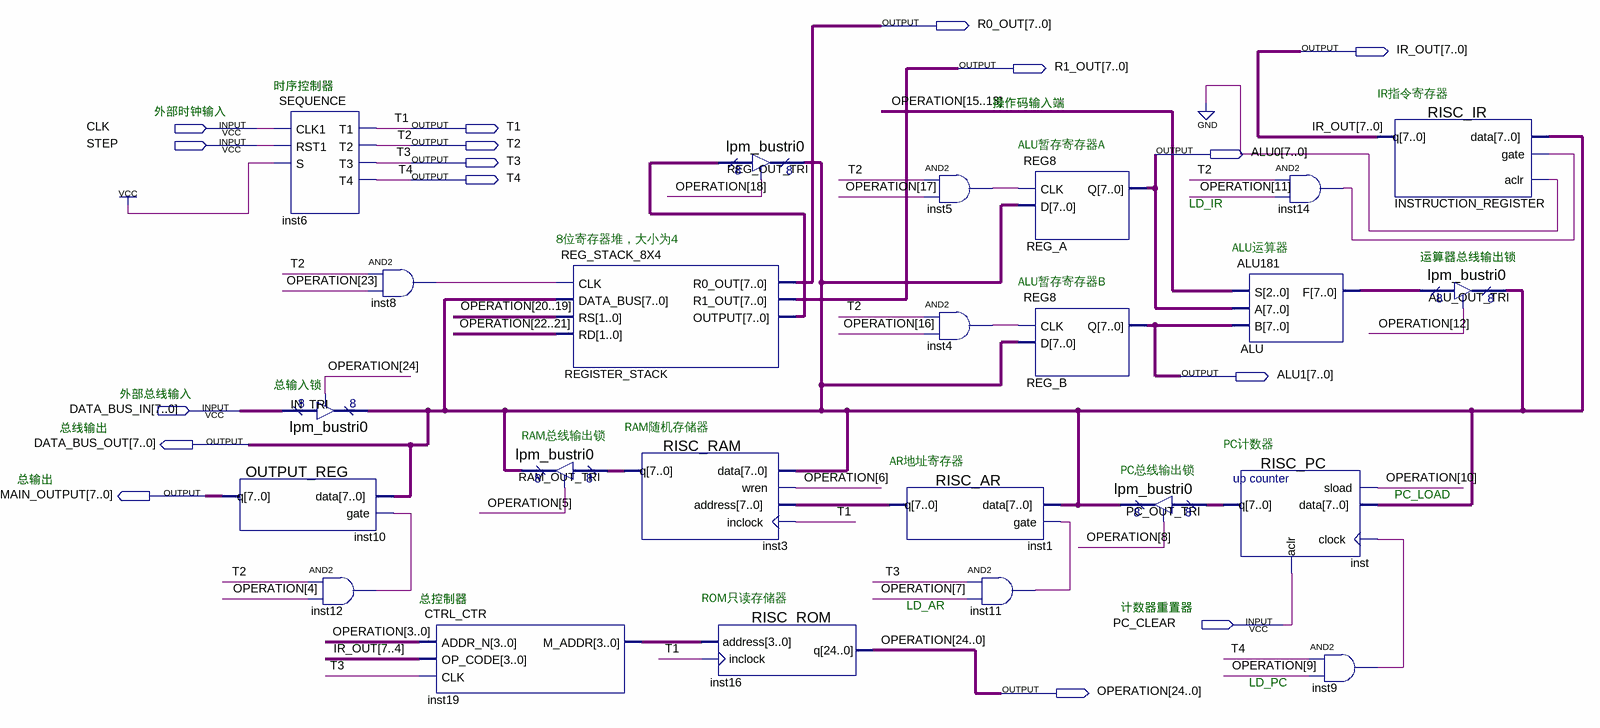
[diagram p0: schematic sheet]
// Quartus schematic RISC_FINALE.bdf as structural Verilog: 24 symbols, 16 pins
module RISC_FINALE (
  input  CLK,
  input  STEP,
  input  [7:0] DATA_BUS_IN,
  input  PC_CLEAR,
  output [7:0] R0_OUT,
  output [7:0] IR_OUT,
  output [7:0] R1_OUT,
  output T1,
  output T2,
  output [7:0] ALU0,
  output T3,
  output T4,
  output [7:0] ALU1,
  output [7:0] DATA_BUS_OUT,
  output [7:0] MAIN_OUTPUT,
  output [24:0] OPERATION
);

  wire inst4_out, inst5_out, inst8_out, inst9_out, inst11_out, inst12_out, inst14_out;
  wire [3:0] inst19_m_addr;
  wire [7:0] ALU_f, inst1_q, inst3_q, inst_q, REGISTER_STACK_output;

  SEQUENCE inst6 (.CLK1(CLK), .RST1(STEP), .S(1'b1), .T1(T1), .T2(T2), .T3(T3), .T4(T4));
  lpm_bustri0 IN_TRI (.enabledt(OPERATION[24]), .data(DATA_BUS_IN), .tridata(DATA_BUS_OUT));
  OUTPUT_REG inst10 (.data(DATA_BUS_OUT), .gate(inst12_out), .q(MAIN_OUTPUT));
  and inst12 (inst12_out, T2, OPERATION[4]);
  and inst8 (inst8_out, T2, OPERATION[23]);
  CTRL_CTR inst19 (.ADDR_N(OPERATION[3:0]), .OP_CODE(IR_OUT[7:4]), .CLK(T3), .M_ADDR(inst19_m_addr));
  REG_STACK_8X4 REGISTER_STACK (
    .CLK(inst8_out), .DATA_BUS(DATA_BUS_OUT), .RS(OPERATION[20:19]), .RD(OPERATION[22:21]), .R0_OUT(R0_OUT),
    .R1_OUT(R1_OUT), .OUTPUT(REGISTER_STACK_output));
  lpm_bustri0 RAM_OUT_TRI (.enabledt(OPERATION[5]), .data(inst3_q), .tridata(DATA_BUS_OUT));
  RISC_RAM inst3 (.data(DATA_BUS_OUT), .wren(OPERATION[6]), .address(inst1_q), .inclock(T1), .q(inst3_q));
  lpm_bustri0 REG_OUT_TRI (.enabledt(OPERATION[18]), .data(REGISTER_STACK_output), .tridata(DATA_BUS_OUT));
  RISC_ROM inst16 (.address(inst19_m_addr), .inclock(T1), .q(OPERATION));
  RISC_AR inst1 (.data(DATA_BUS_OUT), .gate(inst11_out), .q(inst1_q));
  and inst5 (inst5_out, T2, OPERATION[17]);
  and inst4 (inst4_out, T2, OPERATION[16]);
  and inst11 (inst11_out, T3, OPERATION[7]);
  REG8 REG_A (.CLK(inst5_out), .D(DATA_BUS_OUT), .Q(ALU0));
  REG8 REG_B (.CLK(inst4_out), .D(DATA_BUS_OUT), .Q(ALU1));
  lpm_bustri0 PC_OUT_TRI (.enabledt(OPERATION[8]), .data(inst_q), .tridata(DATA_BUS_OUT));
  ALU181 ALU (.S(OPERATION[15:13]), .A(ALU0), .B(ALU1), .F(ALU_f));
  RISC_PC inst (.sload(OPERATION[10]), .data(DATA_BUS_OUT), .clock(inst9_out), .aclr(PC_CLEAR), .q(inst_q));
  and inst14 (inst14_out, T2, OPERATION[11]);
  and inst9 (inst9_out, T4, OPERATION[9]);
  RISC_IR INSTRUCTION_REGISTER (.data(DATA_BUS_OUT), .gate(inst14_out), .aclr(1'b0), .q(IR_OUT));
  lpm_bustri0 ALU_OUT_TRI (.enabledt(OPERATION[12]), .data(ALU_f), .tridata(DATA_BUS_OUT));

  // Notes on the sheet:
  //   时序控制器
  //   IR指令寄存器
  //   操作码输入端
  //   外部时钟输入
  //   ALU暂存寄存器A
  //   LD_IR
  //   8位寄存器堆，大小为4
  //   ALU运算器
  //   运算器总线输出锁
  //   ALU暂存寄存器B
  //   总输入锁
  //   外部总线输入
  //   总线输出
  //   RAM随机存储器
  //   RAM总线输出锁
  //   PC计数器
  //   AR地址寄存器
  //   PC总线输出锁
  //   总输出
  //   PC_LOAD
  //   总控制器
  //   ROM只读存储器
  //   LD_AR
  //   计数器重置器
  //   LD_PC
endmodule
